# EAGLE schematic Base_v8 (EAGLE 9.7.0)
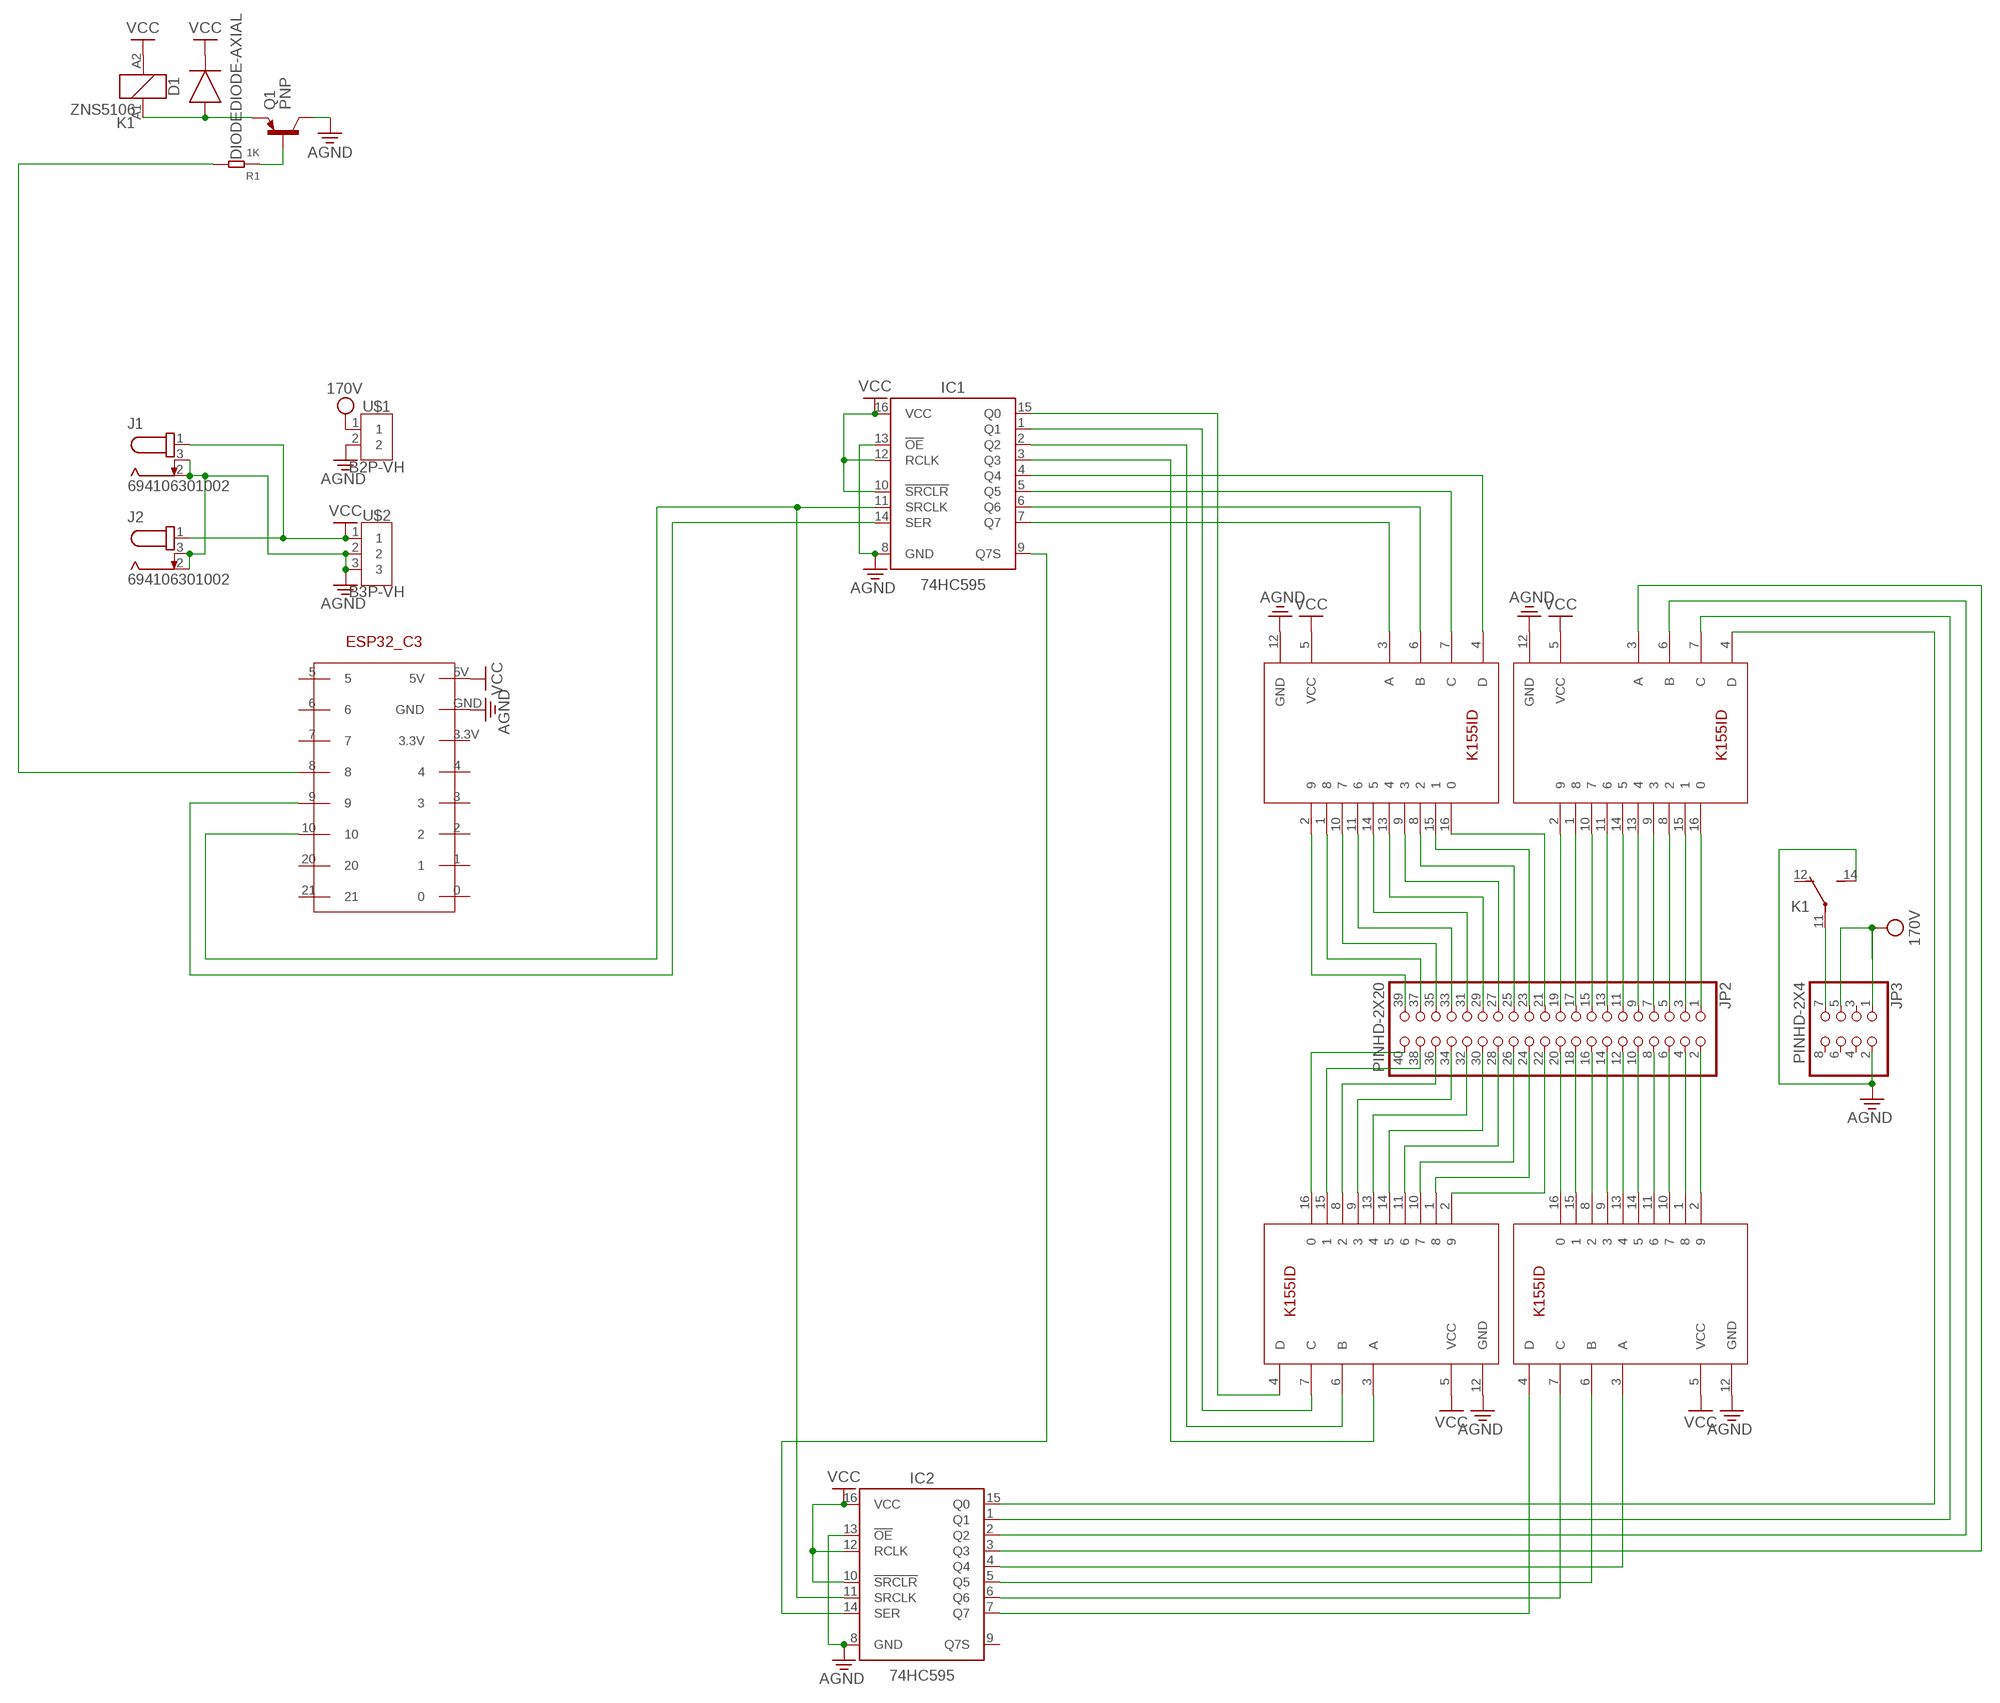
[diagram p0: schematic, sheet 1]

## Parts
D1  DIODEDIODE-AXIAL  [DIODE-AXIAL]
IC1  74HC595  74HC595_PDIP  [DIP762W53P254L1969H508Q16B]
IC2  74HC595  74HC595_PDIP  [DIP762W53P254L1969H508Q16B]
IC3  K155ID  [K155ID]
IC4  K155ID  [K155ID]
IC5  K155ID  [K155ID]
IC6  K155ID  [K155ID]
J1  694106301002  [694106301002]
J2  694106301002  [694106301002]
JP2  PINHD-2X20  [2X20]
JP3  PINHD-2X4  [2X04]
K1  ZNS5106  [ZN5]
Q1  PNP  PNP_TO92-CBE  [TO92]
R1  1K  DIP-RES-1K-5%-1/4W(PR-D2.3XL6.5MM)  [PR-D2.3XL6.5MM]
U$1  B2P-VH  [B2P-VH_396-2N]
U$2  B3P-VH  [B3P-VH_396_3N]
U$5  ESP32_C3_SUPERMINI  [ESP32_C3_SUPERMINI]

## Nets
170V: JP3.1 JP3.5 U$1.1
AGND: IC1.8(GND) IC1.13(!OE) IC2.8(GND) IC2.13(!OE) IC3.12(GND) IC4.12(GND) IC5.12(GND) IC6.12(GND) J1.2 J1.3 J2.2 J2.3 JP3.2 K1.14(2:S) Q1.1(C) U$1.2 U$2.2 U$2.3 U$5.GND
N$1: IC5.16 JP2.1
N$2: IC5.15 JP2.3
N$3: IC5.8 JP2.5
N$4: IC5.9 JP2.7
N$5: IC5.13 JP2.9
N$6: IC5.14 JP2.11
N$7: IC5.11 JP2.13
N$8: IC5.10 JP2.15
N$9: IC5.1 JP2.17
N$10: IC5.2 JP2.19
N$11: IC3.16 JP2.21
N$12: IC3.15 JP2.23
N$13: IC3.8 JP2.25
N$14: IC3.9 JP2.27
N$15: IC3.13 JP2.29
N$16: IC3.14 JP2.31
N$17: IC3.11 JP2.33
N$18: IC3.10 JP2.35
N$19: IC3.1 JP2.37
N$20: IC3.2 JP2.39
N$21: IC6.2 JP2.2
N$22: IC6.1 JP2.4
N$23: IC6.10 JP2.6
N$24: IC6.11 JP2.8
N$25: IC6.14 JP2.10
N$26: IC6.13 JP2.12
N$27: IC6.9 JP2.14
N$28: IC6.8 JP2.16
N$29: IC6.15 JP2.18
N$30: IC6.16 JP2.20
N$31: IC4.16 JP2.40
N$32: IC4.15 JP2.38
N$33: IC4.8 JP2.36
N$34: IC4.9 JP2.34
N$35: IC4.13 JP2.32
N$36: IC4.14 JP2.30
N$37: IC4.11 JP2.28
N$38: IC4.10 JP2.26
N$39: IC4.1 JP2.24
N$40: IC4.2 JP2.22
N$41: IC1.15(Q0) IC4.4(D)
N$42: IC1.1(Q1) IC4.7(C)
N$43: IC1.2(Q2) IC4.6(B)
N$44: IC1.3(Q3) IC4.3(A)
N$45: IC2.4(Q4) IC6.3(A)
N$46: IC2.5(Q5) IC6.6(B)
N$47: IC2.6(Q6) IC6.7(C)
N$48: IC2.7(Q7) IC6.4(D)
N$49: IC1.7(Q7) IC3.3(A)
N$50: IC1.6(Q6) IC3.6(B)
N$51: IC1.5(Q5) IC3.7(C)
N$52: IC1.4(Q4) IC3.4(D)
N$53: IC2.15(Q0) IC5.4(D)
N$54: IC2.1(Q1) IC5.7(C)
N$55: IC2.2(Q2) IC5.6(B)
N$56: IC2.3(Q3) IC5.3(A)
N$57: IC1.9(Q7S) IC2.14(SER)
N$58: IC1.11(SRCLK) IC2.11(SRCLK) U$5.10
N$59: IC1.14(SER) U$5.9
N$60: D1.1(A) K1.A1 Q1.3(E)
N$61: Q1.2(B) R1.1
N$62: R1.2 U$5.8
N$63: JP3.7 K1.11(2:P)
VCC: D1.2(C) IC1.10(!SRCLR) IC1.12(RCLK) IC1.16(VCC) IC2.10(!SRCLR) IC2.12(RCLK) IC2.16(VCC) IC3.5(VCC) IC4.5(VCC) IC5.5(VCC) IC6.5(VCC) J1.1 J2.1 K1.A2 U$2.1 U$5.5V
Unconnected: IC2.9(Q7S) JP3.3 JP3.4 JP3.6 JP3.8 K1.12(2:O) U$5.0 U$5.1 U$5.2 U$5.3 U$5.3.3V U$5.4 U$5.5 U$5.6 U$5.7 U$5.20 U$5.21

## Library data of the parts
D1 = Tinkercad:DIODE: Diode Rectifier - Generic
IC1 IC2 = IC_Logic:74HC595: 8-Bit Shift Registers Reference Datasheet <https://www.ti.com/lit/ds/symlink/sn74hc595.pdf?ts=1637559852861&ref_url=https%253A%252F%252Fwww.google.com%252F>; CATEGORY: IC_Logic; DESCRIPTION: 8-Bit Shift Registers; MANUFACTURER: Generic; MPN: Generic; SUB-CATEGORY: Shift Register; TYPE: 8-bit
IC3-IC6 = K155ID:K155ID
J1 J2 = DC Power Jacks:694106301002: CONN PWR JACK 2.1X5.5MM SOLDER Manufacturer's datasheet <https://katalog.we-online.de/em/datasheet/6941xx301002.pdf>; CREATED_BY: PCBLayout.com; DIGIKEY_PART_NUMBER: 732-5930-ND; MANUFACTURER: Wurth Electronics Inc.; MPN: 694106301002
JP2 = Connector:PINHD-2X20: PIN HEADER; CATEGORY: Headers; DESCRIPTION: Header, Straight, 2x20 Position; MANUFACTURER: Generic; MPN: Generic; OPERATING_TEMPERATURE: Generic; PART_STATUS: Active; PITCH: 0.100" (2.54mm); ROHS_COMPLIANCE: Generic; SERIES: Generic; SUB-CATEGORY: Headers, Male Pins; TYPE: Board to Board or Cable, Unshrouded, Through Hole, Straight
JP3 = Connector:PINHD-2X4: PIN HEADER; CATEGORY: Headers; DESCRIPTION: Header, Straight, 2x4 Position; MANUFACTURER: Generic; MPN: Generic; OPERATING_TEMPERATURE: Generic; PART_STATUS: Active; PITCH: 0.100" (2.54mm); ROHS_COMPLIANCE: Generic; SERIES: Generic; SUB-CATEGORY: Headers, Male Pins; TYPE: Board to Board or Cable, Unshrouded, Through Hole, Straight
K1 = relay:ZNS5*: Miniature Power PCB Relay SCHRACK 1pole 10 A Source: http://www.schrack.com/.. 5847.pdf
Q1 = Transistor:PNP: PNP - Generic; CATEGORY: Transistor; SUB-CATEGORY: BJT; TYPE: PNP
R1 = OPL_Resistor:DIP-RES-1K-5%-1/4W(PR-D2.3XL6.5MM): 301020000; MPN: FHCFR-1/4W-102J
U$1 = Connector:B2P-VH: VH Connector Top Entry - 2POS, 3.96MM Details see: Datasheet <http://www.jst-mfg.com/product/pdf/eng/eVH.pdf>; CATEGORY: Header; DESCRIPTION: Connector Header Through Hole 2 position 0.156" (3.96mm); MANUFACTURER: JST Sales America Inc.; MPN: B2P-VH; OPERATING_TEMPERATURE: -25°C ~ 85°C; PART_STATUS: Active; PITCH: 0.156" (3.96mm); ROHS_COMPLIANCE: RoHS non-compliant; SERIES: VH; SUBCATEGORY: Rectangular Connectors; TYPE: Header, Male Pin, Board to Cable/Wire, Through Hole
U$2 = Connector:B3P-VH: VH Connector Top Entry - POS, 3POS 7.92MM Details see: Datasheet <http://www.jst-mfg.com/product/pdf/eng/eVH.pdf>; CATEGORY: Header; DESCRIPTION: Connector Header Through Hole 3 position 0.156" (3.96mm); MANUFACTURER: JST Sales America Inc.; MPN: B3P-VH; OPERATING_TEMPERATURE: -25°C ~ 85°C; PART_STATUS: Active; PITCH: 0.156" (3.96mm); ROHS_COMPLIANCE: RoHS non-compliant; SERIES: VH; SUBCATEGORY: Rectangular Connectors; TYPE: Header, Male Pin, Board to Cable/Wire, Through Hole
U$5 = ESP32_C3_SUPERMINI:ESP32_C3_SUPERMINI